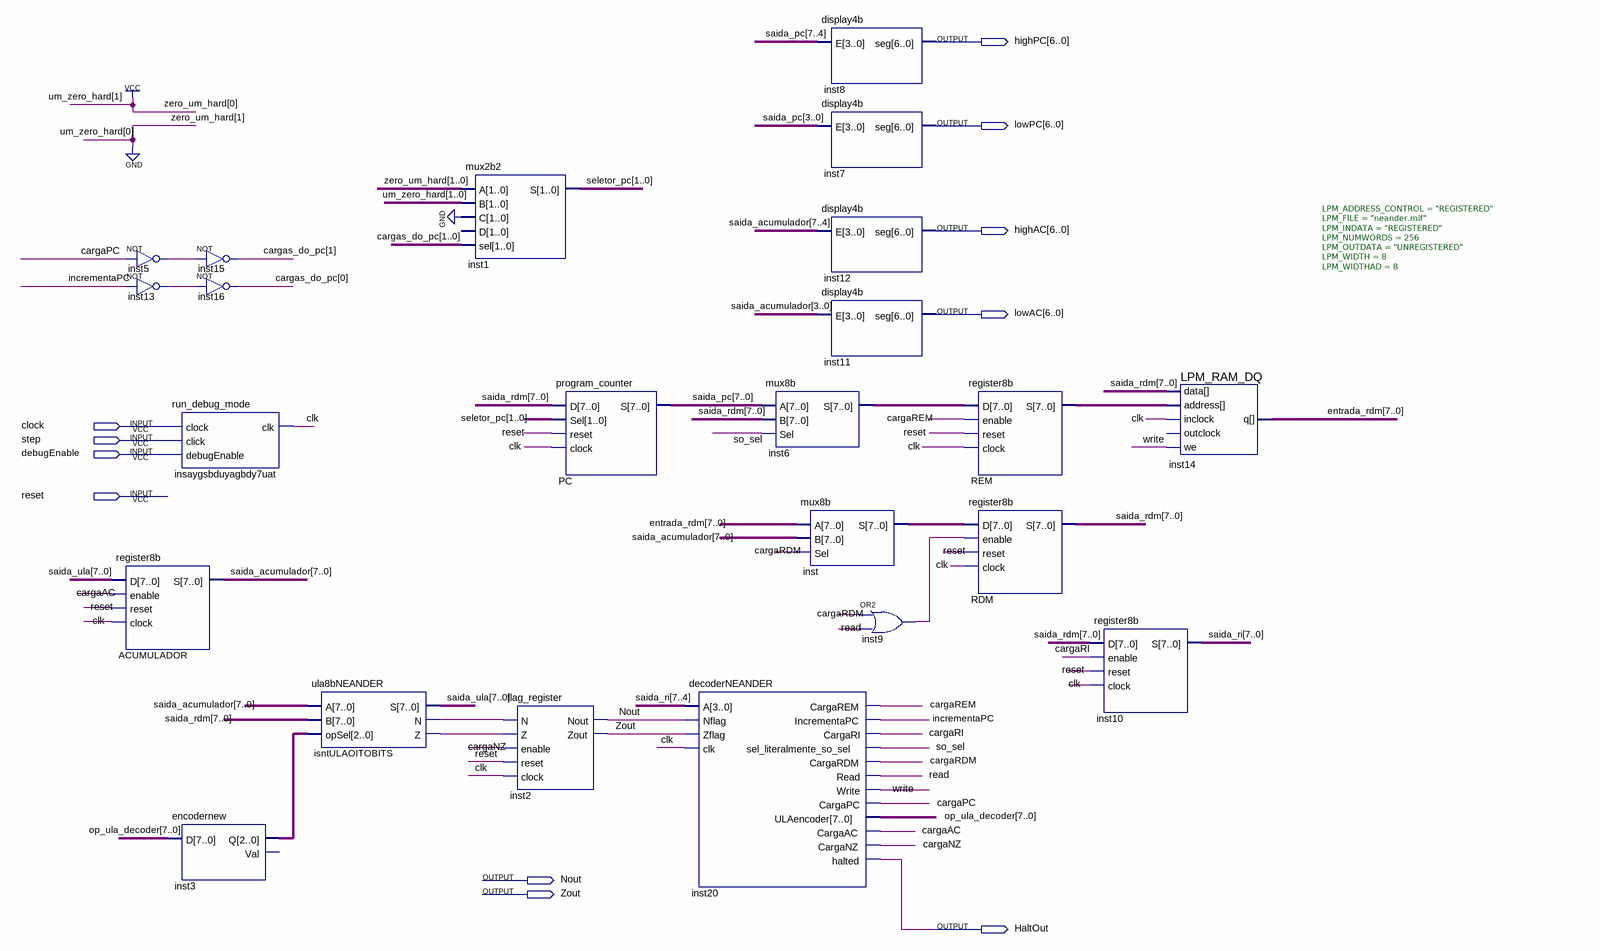
[diagram p0: schematic sheet]
// Quartus schematic neander.bdf as structural Verilog: 23 symbols, 11 pins
module neander (
  input  clock,
  input  step,
  input  debugEnable,
  input  reset,
  output [6:0] highPC,
  output [6:0] lowPC,
  output [6:0] highAC,
  output [6:0] lowAC,
  output Nout,
  output Zout,
  output HaltOut
);

  wire cargaAC, cargaNZ, cargaPC, cargaRDM, cargaREM, cargaRI, clk, incrementaPC, inst5_out, inst9_out,
       inst13_out, isntULAOITOBITS_n, isntULAOITOBITS_z, read, so_sel, write;
  wire [1:0] cargas_do_pc, seletor_pc;
  wire [2:0] inst3_q;
  wire [7:0] entrada_rdm, inst6_s, inst_s, op_ula_decoder, REM_s, saida_acumulador, saida_pc, saida_rdm,
       saida_ri, saida_ula;

  not inst5 (inst5_out, cargaPC);
  not inst13 (inst13_out, incrementaPC);
  register8b ACUMULADOR (.D(saida_ula), .enable(cargaAC), .reset(reset), .clock(clk), .S(saida_acumulador));
  run_debug_mode insaygsbduyagbdy7uat (.clock(clock), .click(step), .debugEnable(debugEnable), .clk(clk));
  encodernew inst3 (.D(op_ula_decoder), .Q(inst3_q));  // open: Val
  not inst15 (cargas_do_pc[1], inst5_out);
  not inst16 (cargas_do_pc[0], inst13_out);
  ula8bNEANDER isntULAOITOBITS (
    .A(saida_acumulador), .B(saida_rdm), .opSel(inst3_q), .S(saida_ula), .N(isntULAOITOBITS_n),
    .Z(isntULAOITOBITS_z));
  mux2b2 inst1 (.A(2'b01), .B(2'b10), .C(2'b00), .sel(cargas_do_pc), .S(seletor_pc));  // open: D
  flag_register inst2 (
    .N(isntULAOITOBITS_n), .Z(isntULAOITOBITS_z), .enable(cargaNZ), .reset(reset), .clock(clk), .Nout(Nout),
    .Zout(Zout));
  program_counter PC (.D(saida_rdm), .Sel(seletor_pc), .reset(reset), .clock(clk), .S(saida_pc));
  decoderNEANDER inst20 (
    .A(saida_ri[7:4]), .Nflag(Nout), .Zflag(Zout), .clk(clk), .CargaREM(cargaREM),
    .IncrementaPC(incrementaPC), .CargaRI(cargaRI), .sel_literalmente_so_sel(so_sel), .CargaRDM(cargaRDM),
    .Read(read), .Write(write), .CargaPC(cargaPC), .ULAencoder(op_ula_decoder), .CargaAC(cargaAC),
    .CargaNZ(cargaNZ), .halted(HaltOut));
  mux8b inst6 (.A(saida_pc), .B(saida_rdm), .Sel(so_sel), .S(inst6_s));
  mux8b inst (.A(entrada_rdm), .B(saida_acumulador), .Sel(cargaRDM), .S(inst_s));
  display4b inst8 (.E(saida_pc[7:4]), .seg(highPC));
  display4b inst7 (.E(saida_pc[3:0]), .seg(lowPC));
  display4b inst12 (.E(saida_acumulador[7:4]), .seg(highAC));
  display4b inst11 (.E(saida_acumulador[3:0]), .seg(lowAC));
  or inst9 (inst9_out, cargaRDM, read);
  register8b REM (.D(inst6_s), .enable(cargaREM), .reset(reset), .clock(clk), .S(REM_s));
  register8b RDM (.D(inst_s), .enable(inst9_out), .reset(reset), .clock(clk), .S(saida_rdm));
  register8b inst10 (.D(saida_rdm), .enable(cargaRI), .reset(reset), .clock(clk), .S(saida_ri));
  LPM_RAM_DQ #(.LPM_ADDRESS_CONTROL("REGISTERED"), .LPM_FILE("neander.mif"), .LPM_INDATA("REGISTERED"), .LPM_NUMWORDS(256), .LPM_OUTDATA("UNREGISTERED"), .LPM_WIDTH(8), .LPM_WIDTHAD(8)) inst14 (
    .inclock(clk), .data(saida_rdm), .address(REM_s), .we(write), .q(entrada_rdm));  // open: outclock
endmodule
